# EAGLE schematic SK3000v4  (EAGLE 7.1.0)
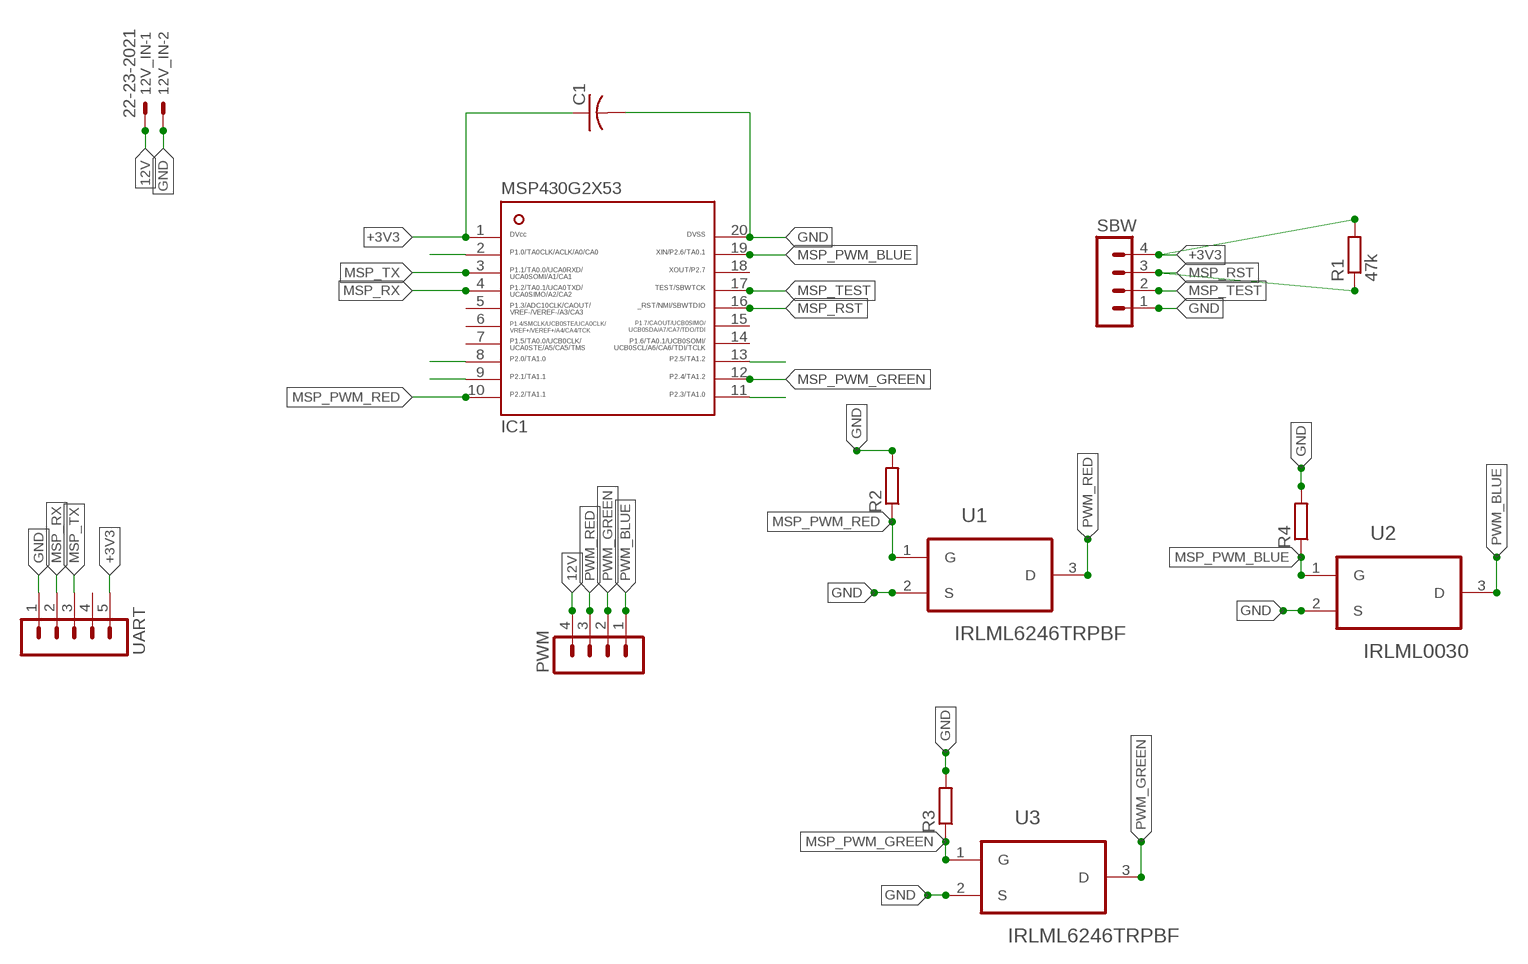
[diagram p0: schematic, sheet 1]

## Parts
12V_IN  22-23-2021  [22-23-2021]
C1  C-USC0603  [C0603]
IC1  MSP430G2553  MSP430G2X53-20PW20  [PW20]
PWM  MA04-1  [MA04-1]
R1  47k  R-EU_R0603  [R0603]
R2  R-EU_R0603  [R0603]
R3  R-EU_R0603  [R0603]
R4  R-EU_R0603  [R0603]
SBW  MA04-1  [MA04-1]
U1  IRLML6246TRPBF  [SOT95P240X112-3N]
U2  IRLML0030  IRLML6246TRPBF  [SOT95P240X112-3N]
U3  IRLML6246TRPBF  [SOT95P240X112-3N]
UART  MA05-1  [MA05-1]

## Nets
12V: 12V_IN.1 PWM.4
+3V3: C1.1 IC1.1 R1.2 SBW.4 UART.5
GND: 12V_IN.2 C1.2 IC1.20 R2.2 R3.2 R4.2 SBW.1 U1.2(S) U2.2(S) U3.2(S) UART.1
MSP_PWM_BLUE: IC1.19 R4.1 U2.1(G)
MSP_PWM_GREEN: IC1.12 R3.1 U3.1(G)
MSP_PWM_RED: IC1.10 R2.1 U1.1(G)
MSP_RST: IC1.16 R1.1 SBW.3
MSP_RX: IC1.4 UART.2
MSP_TEST: IC1.17 SBW.2
MSP_TX: IC1.3 UART.3
N$32: IC1.2
N$33: IC1.8
N$34: IC1.9
N$36: IC1.13
N$37: IC1.11
PWM_BLUE: PWM.1 U2.3(D)
PWM_GREEN: PWM.2 U3.3(D)
PWM_RED: PWM.3 U1.3(D)
Unconnected: IC1.5 IC1.6 IC1.7 IC1.14 IC1.15 IC1.18 UART.4

## Library data of the parts
12V_IN = con-molex:22-23-2021: .100" (2.54mm) Center Header - 2 Pin; MF: MOLEX; MPN: 22-23-2021; OC_FARNELL: 1462926; OC_NEWARK: 25C3832
C1 = adafruit:C-US: CAPACITOR, American symbol
IC1 = ti_msp430:MSP430G2X53-20
PWM SBW = con-lstb:MA04-1: PIN HEADER; OC_FARNELL: unknown; OC_NEWARK: unknown
R1-R4 = rcl:R-EU_: RESISTOR, European symbol
U1-U3 = International_Rectifier_By_element14_Batch_1:IRLML6246TRPBF: Power MOSFET; MPN: IRLML6246TRPBF; OC_FARNELL: 1857343; OC_NEWARK: 84R9707; PACKAGE: SOT-23-3; SUPPLIER: INTERNATIONAL RECTIFIER
UART = con-lstb:MA05-1: PIN HEADER; OC_FARNELL: unknown; OC_NEWARK: unknown